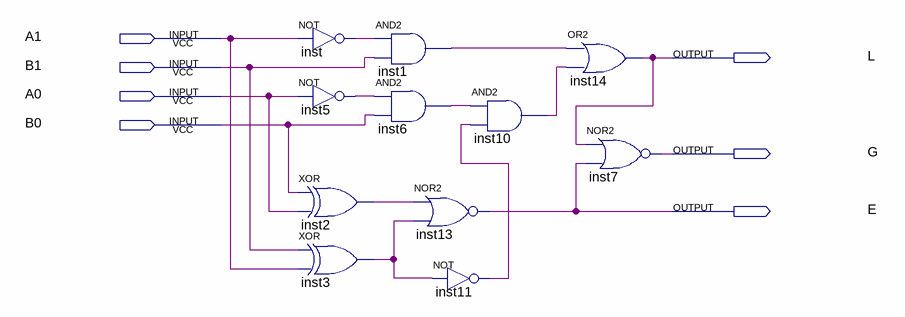
[diagram p0: schematic sheet]
// Quartus schematic Question3alt.bdf as structural Verilog: 11 symbols, 7 pins
module Question3alt (
  input  A1,
  input  B1,
  input  A0,
  input  B0,
  output L,
  output G,
  output E
);

  wire inst1_out, inst2_out, inst3_out, inst5_out, inst6_out, inst10_out, inst11_out, inst_out;

  not inst (inst_out, A1);
  not inst5 (inst5_out, A0);
  xor inst2 (inst2_out, B0, A0);
  xor inst3 (inst3_out, B1, A1);
  and inst1 (inst1_out, inst_out, B1);
  and inst6 (inst6_out, inst5_out, B0);
  nor inst13 (E, inst2_out, inst3_out);
  not inst11 (inst11_out, inst3_out);
  and inst10 (inst10_out, inst6_out, inst11_out);
  or inst14 (L, inst1_out, inst10_out);
  nor inst7 (G, L, E);
endmodule
